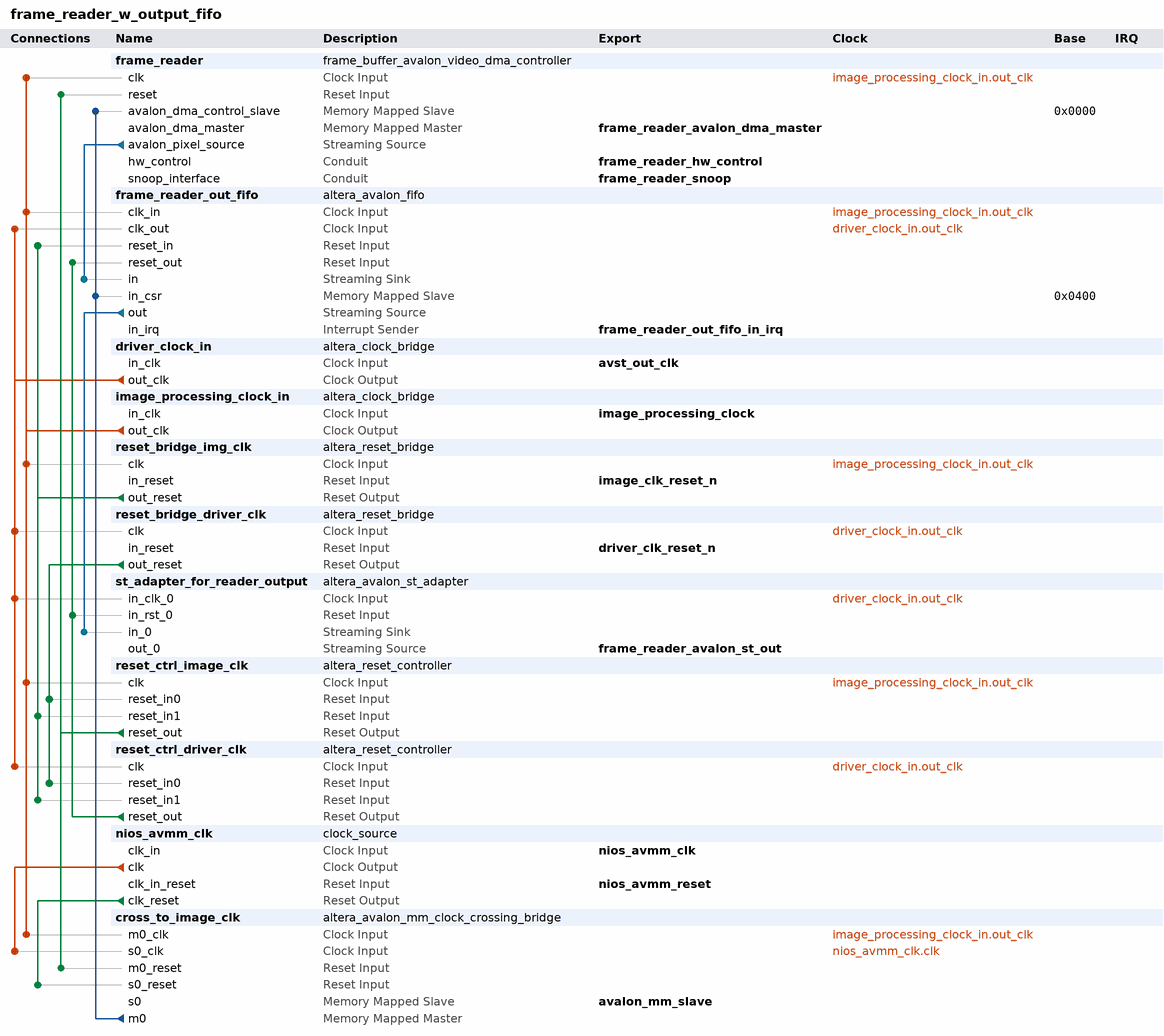
[diagram p0: system contents]
# Platform Designer (Qsys) system frame_reader_w_output_fifo, Stratix IV EP4SGX230KF40C2
# Parameters at their usual value, and those the tool derives, are not listed.
package require -exact qsys 18.1
create_system frame_reader_w_output_fifo
set_project_property DEVICE_FAMILY {Stratix IV}
set_project_property DEVICE EP4SGX230KF40C2

add_instance frame_reader frame_buffer_avalon_video_dma_controller 14.1
set_instance_parameter_value frame_reader address_width 32
set_instance_parameter_value frame_reader always_do_buffer_swap true
set_instance_parameter_value frame_reader bits_per_pixel 16
set_instance_parameter_value frame_reader dma_enabled true
set_instance_parameter_value frame_reader mode {From Memory to Stream}
set_instance_parameter_value frame_reader num_pixels_in_frame 1048576
set_instance_parameter_value frame_reader num_watchdog_bits 64
set_instance_parameter_value frame_reader override_external_swap_buffers_now false
set_instance_parameter_value frame_reader override_val_for_external_swap_buffers_now false
set_instance_parameter_value frame_reader parallelization_ratio 2
set_instance_parameter_value frame_reader swap_symbols_for_ddr_write false
set_instance_parameter_value frame_reader use_external_backbuffer true
set_instance_parameter_value frame_reader watchdog_count 2000000000
set_instance_parameter_value frame_reader watchdog_enabled true

add_instance frame_reader_out_fifo altera_avalon_fifo 18.1
set_instance_parameter_value frame_reader_out_fifo bitsPerSymbol 16
set_instance_parameter_value frame_reader_out_fifo channelWidth 0
set_instance_parameter_value frame_reader_out_fifo errorWidth 0
set_instance_parameter_value frame_reader_out_fifo fifoDepth 512
set_instance_parameter_value frame_reader_out_fifo fifoInputInterfaceOptions AVALONST_SINK
set_instance_parameter_value frame_reader_out_fifo fifoOutputInterfaceOptions AVALONST_SOURCE
set_instance_parameter_value frame_reader_out_fifo singleClockMode false
set_instance_parameter_value frame_reader_out_fifo symbolsPerBeat 4
set_instance_parameter_value frame_reader_out_fifo useIRQ true
set_instance_parameter_value frame_reader_out_fifo usePacket true
set_instance_parameter_value frame_reader_out_fifo useReadControl false

add_instance driver_clock_in altera_clock_bridge 18.1
set_instance_parameter_value driver_clock_in DERIVED_CLOCK_RATE 0
set_instance_parameter_value driver_clock_in EXPLICIT_CLOCK_RATE 0

add_instance image_processing_clock_in altera_clock_bridge 18.1
set_instance_parameter_value image_processing_clock_in DERIVED_CLOCK_RATE 0
set_instance_parameter_value image_processing_clock_in EXPLICIT_CLOCK_RATE 0

add_instance reset_bridge_img_clk altera_reset_bridge 18.1
set_instance_parameter_value reset_bridge_img_clk ACTIVE_LOW_RESET 1
set_instance_parameter_value reset_bridge_img_clk SYNCHRONOUS_EDGES both

add_instance reset_bridge_driver_clk altera_reset_bridge 18.1
set_instance_parameter_value reset_bridge_driver_clk ACTIVE_LOW_RESET 1
set_instance_parameter_value reset_bridge_driver_clk SYNCHRONOUS_EDGES both

add_instance st_adapter_for_reader_output altera_avalon_st_adapter 18.1
set_instance_parameter_value st_adapter_for_reader_output inBitsPerSymbol 16
set_instance_parameter_value st_adapter_for_reader_output inChannelWidth 0
set_instance_parameter_value st_adapter_for_reader_output inDataWidth 64
set_instance_parameter_value st_adapter_for_reader_output inErrorWidth 0
set_instance_parameter_value st_adapter_for_reader_output inMaxChannel 0
set_instance_parameter_value st_adapter_for_reader_output inReadyLatency 0
set_instance_parameter_value st_adapter_for_reader_output inUseEmptyPort 0
set_instance_parameter_value st_adapter_for_reader_output inUsePackets 1
set_instance_parameter_value st_adapter_for_reader_output inUseReady 1
set_instance_parameter_value st_adapter_for_reader_output inUseValid 1
set_instance_parameter_value st_adapter_for_reader_output outChannelWidth 0
set_instance_parameter_value st_adapter_for_reader_output outDataWidth 16
set_instance_parameter_value st_adapter_for_reader_output outErrorWidth 0
set_instance_parameter_value st_adapter_for_reader_output outMaxChannel 0
set_instance_parameter_value st_adapter_for_reader_output outReadyLatency 0
set_instance_parameter_value st_adapter_for_reader_output outUseEmptyPort 0
set_instance_parameter_value st_adapter_for_reader_output outUseReady 1
set_instance_parameter_value st_adapter_for_reader_output outUseValid 1

add_instance reset_ctrl_image_clk altera_reset_controller 18.1
set_instance_parameter_value reset_ctrl_image_clk NUM_RESET_INPUTS 2
set_instance_parameter_value reset_ctrl_image_clk SYNC_DEPTH 3

add_instance reset_ctrl_driver_clk altera_reset_controller 18.1
set_instance_parameter_value reset_ctrl_driver_clk NUM_RESET_INPUTS 2
set_instance_parameter_value reset_ctrl_driver_clk SYNC_DEPTH 3

add_instance nios_avmm_clk clock_source 18.1
set_instance_parameter_value nios_avmm_clk clockFrequency 50000000
set_instance_parameter_value nios_avmm_clk resetSynchronousEdges BOTH

add_instance cross_to_image_clk altera_avalon_mm_clock_crossing_bridge 18.1
set_instance_parameter_value cross_to_image_clk ADDRESS_WIDTH 10
set_instance_parameter_value cross_to_image_clk COMMAND_FIFO_DEPTH 4
set_instance_parameter_value cross_to_image_clk DATA_WIDTH 32
set_instance_parameter_value cross_to_image_clk MASTER_SYNC_DEPTH 2
set_instance_parameter_value cross_to_image_clk MAX_BURST_SIZE 1
set_instance_parameter_value cross_to_image_clk RESPONSE_FIFO_DEPTH 4
set_instance_parameter_value cross_to_image_clk SLAVE_SYNC_DEPTH 2
set_instance_parameter_value cross_to_image_clk USE_AUTO_ADDRESS_WIDTH 1

# connections
add_connection driver_clock_in.out_clk frame_reader_out_fifo.clk_out clock
add_connection driver_clock_in.out_clk reset_bridge_driver_clk.clk clock
add_connection driver_clock_in.out_clk reset_ctrl_driver_clk.clk clock
add_connection driver_clock_in.out_clk st_adapter_for_reader_output.in_clk_0 clock
add_connection image_processing_clock_in.out_clk cross_to_image_clk.m0_clk clock
add_connection image_processing_clock_in.out_clk frame_reader.clk clock
add_connection image_processing_clock_in.out_clk frame_reader_out_fifo.clk_in clock
add_connection image_processing_clock_in.out_clk reset_bridge_img_clk.clk clock
add_connection image_processing_clock_in.out_clk reset_ctrl_image_clk.clk clock
add_connection nios_avmm_clk.clk cross_to_image_clk.s0_clk clock
add_connection nios_avmm_clk.clk_reset cross_to_image_clk.s0_reset reset
add_connection reset_bridge_driver_clk.out_reset reset_ctrl_driver_clk.reset_in0 reset
add_connection reset_bridge_driver_clk.out_reset reset_ctrl_image_clk.reset_in0 reset
add_connection reset_bridge_img_clk.out_reset frame_reader_out_fifo.reset_in reset
add_connection reset_bridge_img_clk.out_reset reset_ctrl_driver_clk.reset_in1 reset
add_connection reset_bridge_img_clk.out_reset reset_ctrl_image_clk.reset_in1 reset
add_connection reset_ctrl_driver_clk.reset_out frame_reader_out_fifo.reset_out reset
add_connection reset_ctrl_driver_clk.reset_out st_adapter_for_reader_output.in_rst_0 reset
add_connection reset_ctrl_image_clk.reset_out cross_to_image_clk.m0_reset reset
add_connection reset_ctrl_image_clk.reset_out frame_reader.reset reset
add_connection cross_to_image_clk.m0 frame_reader.avalon_dma_control_slave avalon
set_connection_parameter_value cross_to_image_clk.m0/frame_reader.avalon_dma_control_slave baseAddress 0x0000
add_connection cross_to_image_clk.m0 frame_reader_out_fifo.in_csr avalon
set_connection_parameter_value cross_to_image_clk.m0/frame_reader_out_fifo.in_csr baseAddress 0x0400
add_connection frame_reader.avalon_pixel_source frame_reader_out_fifo.in avalon_streaming
add_connection frame_reader_out_fifo.out st_adapter_for_reader_output.in_0 avalon_streaming

# exported interfaces
add_interface avalon_mm_slave avalon slave
set_interface_property avalon_mm_slave EXPORT_OF cross_to_image_clk.s0
add_interface avst_out_clk clock sink
set_interface_property avst_out_clk EXPORT_OF driver_clock_in.in_clk
add_interface driver_clk_reset_n reset sink
set_interface_property driver_clk_reset_n EXPORT_OF reset_bridge_driver_clk.in_reset
add_interface frame_reader_avalon_dma_master avalon master
set_interface_property frame_reader_avalon_dma_master EXPORT_OF frame_reader.avalon_dma_master
add_interface frame_reader_avalon_st_out avalon_streaming source
set_interface_property frame_reader_avalon_st_out EXPORT_OF st_adapter_for_reader_output.out_0
add_interface frame_reader_hw_control conduit end
set_interface_property frame_reader_hw_control EXPORT_OF frame_reader.hw_control
add_interface frame_reader_out_fifo_in_irq interrupt sender
set_interface_property frame_reader_out_fifo_in_irq EXPORT_OF frame_reader_out_fifo.in_irq
add_interface frame_reader_snoop conduit end
set_interface_property frame_reader_snoop EXPORT_OF frame_reader.snoop_interface
add_interface image_clk_reset_n reset sink
set_interface_property image_clk_reset_n EXPORT_OF reset_bridge_img_clk.in_reset
add_interface image_processing_clock clock sink
set_interface_property image_processing_clock EXPORT_OF image_processing_clock_in.in_clk
add_interface nios_avmm_clk clock sink
set_interface_property nios_avmm_clk EXPORT_OF nios_avmm_clk.clk_in
add_interface nios_avmm_reset reset sink
set_interface_property nios_avmm_reset EXPORT_OF nios_avmm_clk.clk_in_reset

set_interconnect_requirement {$system} qsys_mm.clockCrossingAdapter AUTO
set_interconnect_requirement {$system} qsys_mm.maxAdditionalLatency 3

save_system frame_reader_w_output_fifo.qsys
